# EAGLE design ads_pcb_v2 (EAGLE 7.7.0)
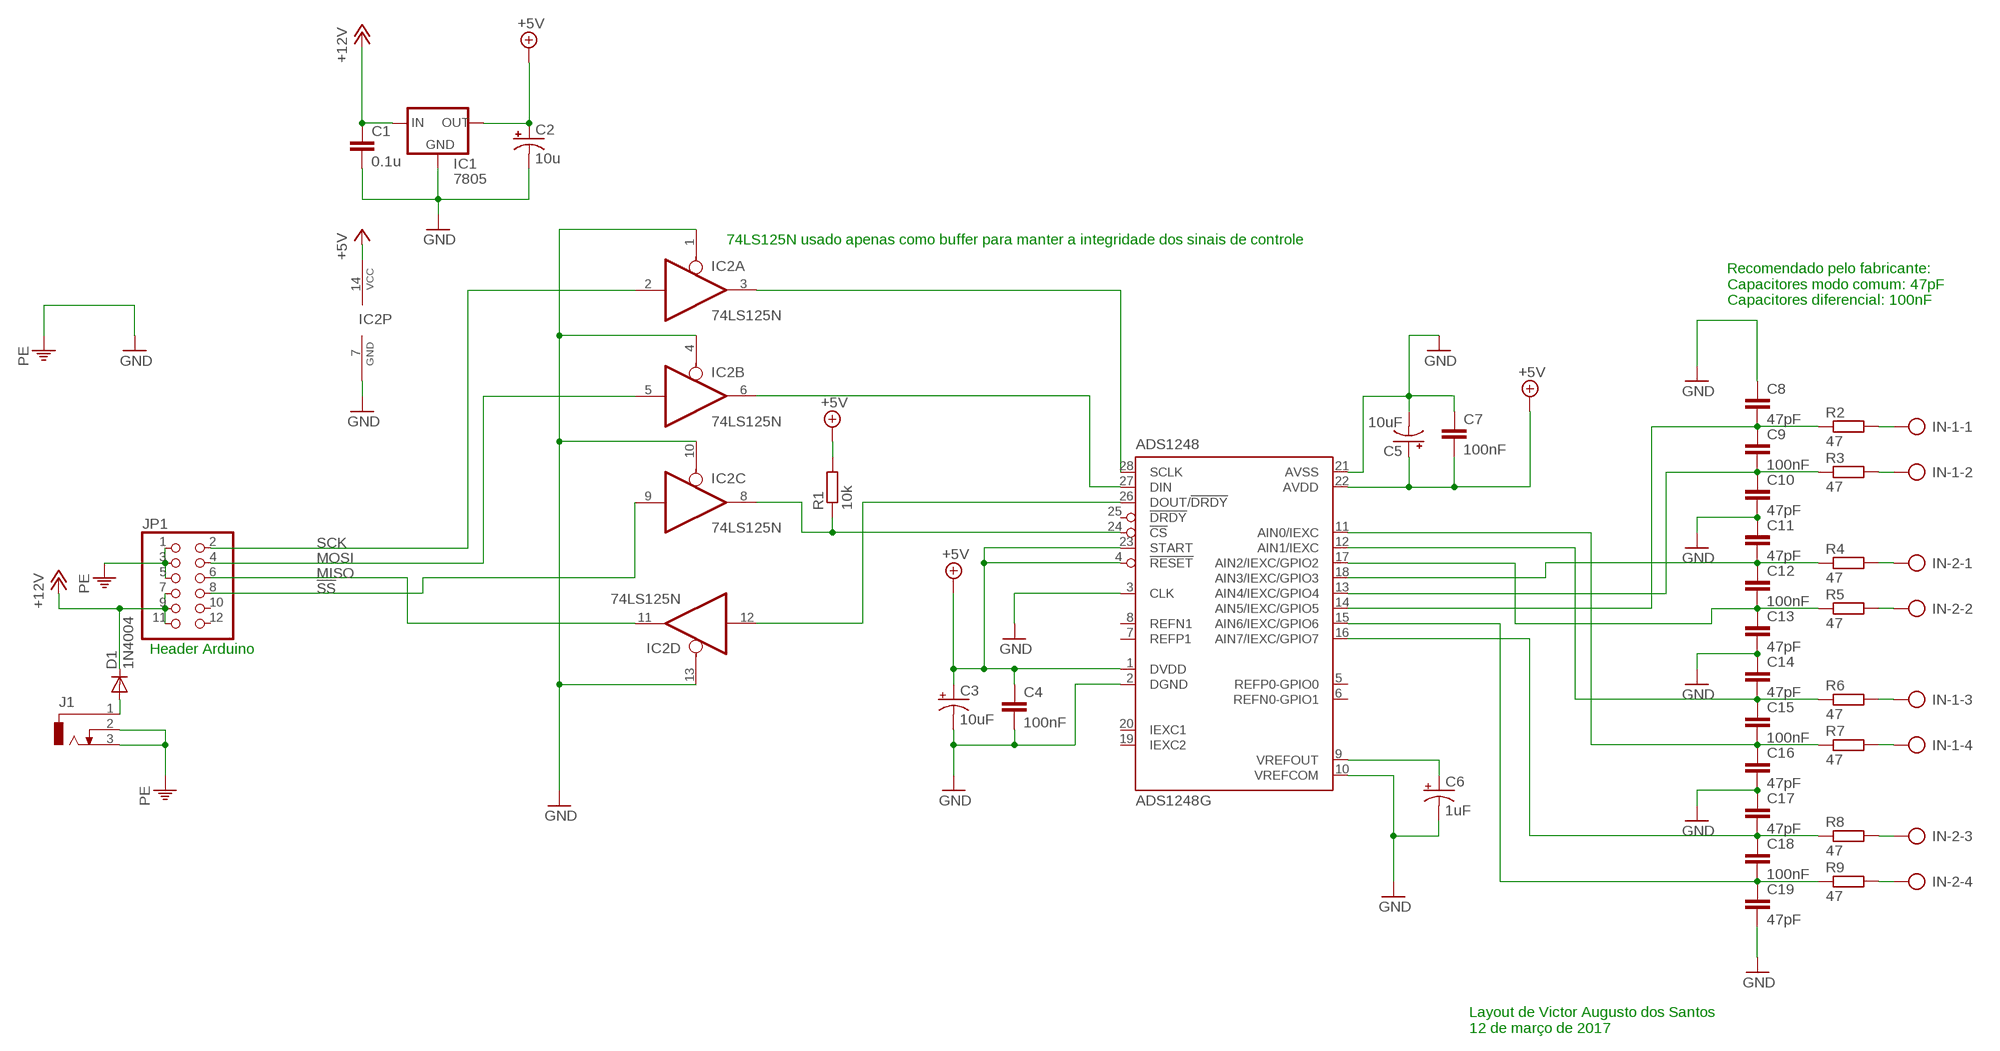
[diagram p0: schematic, sheet 1]

## Parts
C1  0.1u  C5/3  [C5B3]
C2  10u  CPOL-USE2-5  [E2-5]
C3  10uF  CPOL-USE2-5  [E2-5]
C4  100nF  C5/3  [C5B3]
C5  10uF  CPOL-USE2-5  [E2-5]
C6  1uF  CPOL-USE2-5  [E2-5]
C7  100nF  C5/3  [C5B3]
C8  47pF  C5/2.5  [C5B2.5]
C9  100nF  C5/2.5  [C5B2.5]
C10  47pF  C5/2.5  [C5B2.5]
C11  47pF  C5/2.5  [C5B2.5]
C12  100nF  C5/2.5  [C5B2.5]
C13  47pF  C5/2.5  [C5B2.5]
C14  47pF  C5/2.5  [C5B2.5]
C15  100nF  C5/2.5  [C5B2.5]
C16  47pF  C5/3  [C5B3]
C17  47pF  C5/2.5  [C5B2.5]
C18  100nF  C5/2.5  [C5B2.5]
C19  47pF  C5/2.5  [C5B2.5]
D1  1N4004  [DO41-10]
IC1  7805  78XXL  [78XXL]
IC2  74LS125N  [DIL14]
IC3  ADS1248G  [P-TSSOP28-1]
IN-1  AK500/4-H  [AK500/4-H]
IN-2  AK500/4-H  [AK500/4-H]
J1  DCJ0303  [DCJ0303]
JP1  PINHD-2X6  [2X06]
R1  10k  R-EU_0204/7  [0204/7]
R2  47  R-EU_0204/7  [0204/7]
R3  47  R-EU_0204/7  [0204/7]
R4  47  R-EU_0204/7  [0204/7]
R5  47  R-EU_0204/7  [0204/7]
R6  47  R-EU_0204/7  [0204/7]
R7  47  R-EU_0204/7  [0204/7]
R8  47  R-EU_0204/7  [0204/7]
R9  47  R-EU_0204/7  [0204/7]

## Nets
!SS: IC2.9(C:I) JP1.8
+5V: C2.+ C3.+ C4.1 C5.+ C7.2 IC1.OUT IC2.14(P:VCC) IC3.1(DVDD) IC3.4(!RESET) IC3.22(AVDD) IC3.23(START) R1.2
+12V: C1.1 D1.C IC1.IN JP1.7 JP1.9 JP1.11
GND: C1.2 C2.- C3.- C4.2 C5.- C6.- C7.1 C8.1 C10.2 C11.1 C13.2 C14.1 C16.2 C17.1 C19.2 IC1.GND IC2.1(A:OE) IC2.4(B:OE) IC2.7(P:GND) IC2.10(C:OE) IC2.13(D:OE) IC3.2(DGND) IC3.3(CLK) IC3.10(VREFCOM) IC3.21(AVSS) ; supply symbol labelled PE
MISO: IC2.11(D:O) JP1.6
MOSI: IC2.5(B:I) JP1.4
N$1: C6.+ IC3.9(VREFOUT)
N$2: C8.2 C9.1 IC3.14(AIN5/IEXC/GPIO5) R2.1
N$3: C9.2 C10.1 IC3.13(AIN4/IEXC/GPIO4) R3.1
N$4: IN-2.1 R4.2
N$5: IC2.3(A:O) IC3.28(SCLK)
N$6: IN-2.2 R5.2
N$7: C11.2 C12.1 IC3.18(AIN3/IEXC/GPIO3) R4.1
N$8: IN-1.3 R6.2
N$9: IN-1.4 R7.2
N$10: IN-2.3 R8.2
N$11: IC2.6(B:O) IC3.27(DIN)
N$12: IC2.12(D:I) IC3.26(DOUT/!DRDY)
N$13: IC2.8(C:O) IC3.24(!CS) R1.1
N$14: D1.A J1.1
N$15: IN-2.4 R9.2
N$16: IN-1.1 R2.2
N$18: IN-1.2 R3.2
N$21: C12.2 C13.1 IC3.17(AIN2/IEXC/GPIO2) R5.1
N$22: C17.2 C18.1 IC3.16(AIN7/IEXC/GPIO7) R8.1
N$23: C18.2 C19.1 IC3.15(AIN6/IEXC/GPIO6) R9.1
N$25: C15.2 C16.1 IC3.11(AIN0/IEXC) R7.1
N$26: C14.2 C15.1 IC3.12(AIN1/IEXC) R6.1
PE: J1.2 J1.3 JP1.1 JP1.3 JP1.5
SCK: IC2.2(A:I) JP1.2
Unconnected: IC3.5(REFP0-GPIO0) IC3.6(REFN0-GPIO1) IC3.7(REFP1) IC3.8(REFN1) IC3.19(IEXC2) IC3.20(IEXC1) IC3.25(!DRDY) JP1.10 JP1.12

## Notes on the sheet
- 74LS125N usado apenas como buffer para manter a integridade dos sinais de controle
- Recomendado pelo fabricante:
  Capacitores modo comum: 47pF
  Capacitores diferencial: 100nF
- Header Arduino
- Layout de Victor Augusto dos Santos
  12 de março de 2017

## Library data of the parts
C1 C4 C7-C19 = capacitor-wima:C: CAPACITOR naming: grid - package width
C2 C3 C5 C6 = resistor:CPOL-US: POLARIZED CAPACITOR, American symbol
D1 = adafruit:1N4004: DIODE General purpose 1N400x type rectifier (With bigger pads) http://www.ladyada.net/library/pcb/eaglelibrary.html
IC1 = v-reg:78XXL: VOLTAGE REGULATOR
IC2 = 74xx-us:74*125: Quad bus BUFFER, 3-state
IC3 = mylib:ADS1248: Phase locked loop (PLL), with a multistandard video modulator and a programmable sound FM and AM modulator
IN-1 IN-2 = con-ptr500:AK500/4-H: CONNECTOR Aug. 2004 / PTR Meßtechnik: Die Bezeichnung der Serie AK505 wurde geändert. Es handelt sich hierbei um AK500 in horizontaler Ausführung.
J1 = con-jack:DCJ0303: DC POWER JACK Source: DCJ0303.pdf; OC_FARNELL: unknown; OC_NEWARK: unknown
JP1 = pinhead:PINHD-2X6: PIN HEADER
R1-R9 = resistor:R-EU_: RESISTOR, European symbol

## Board
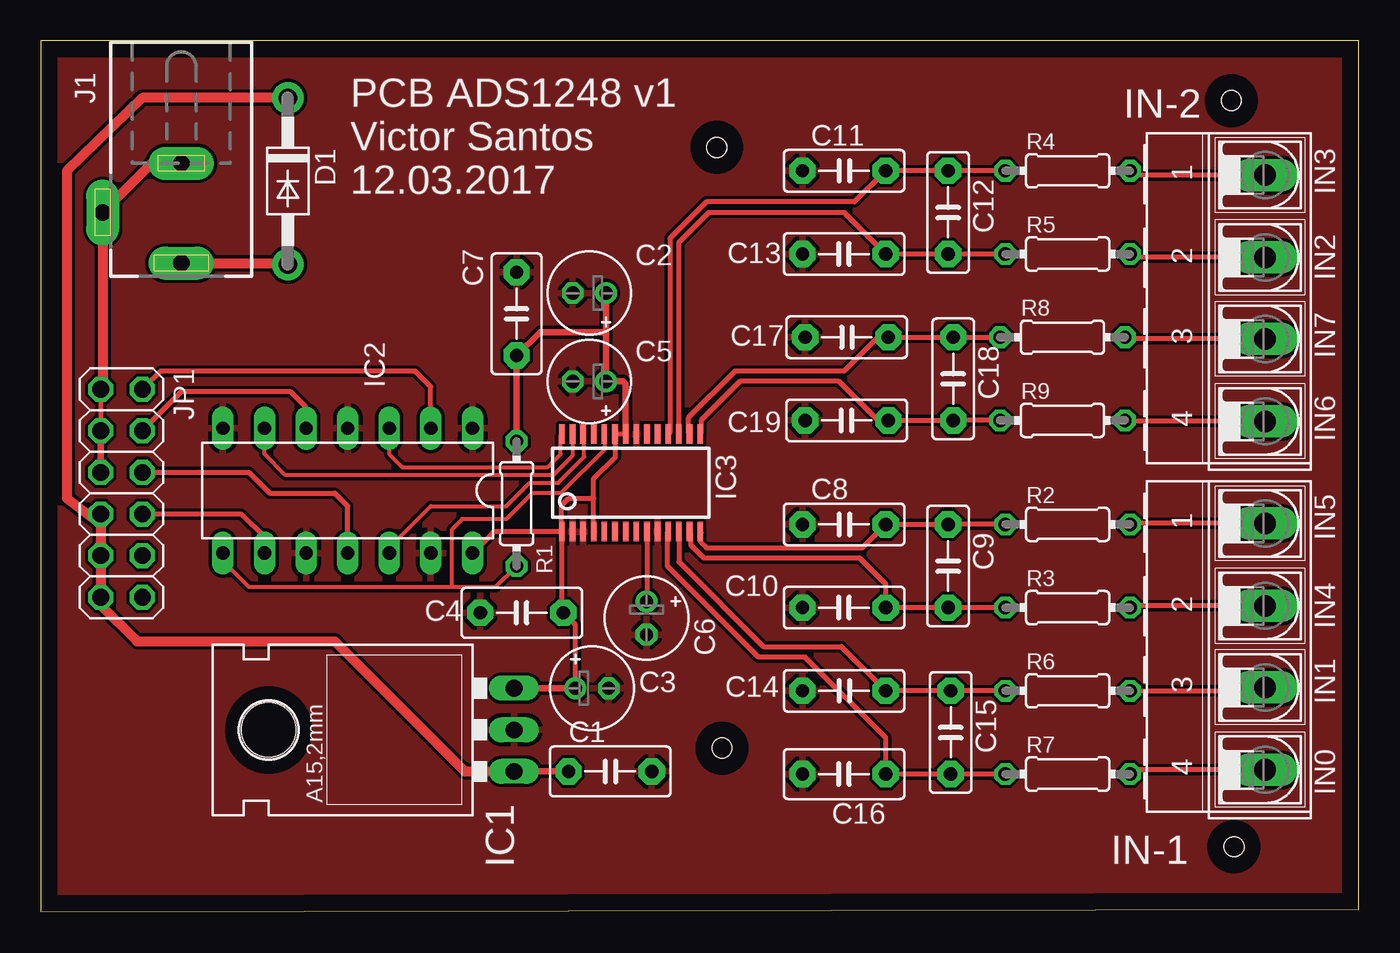
[diagram p1: board, top side]
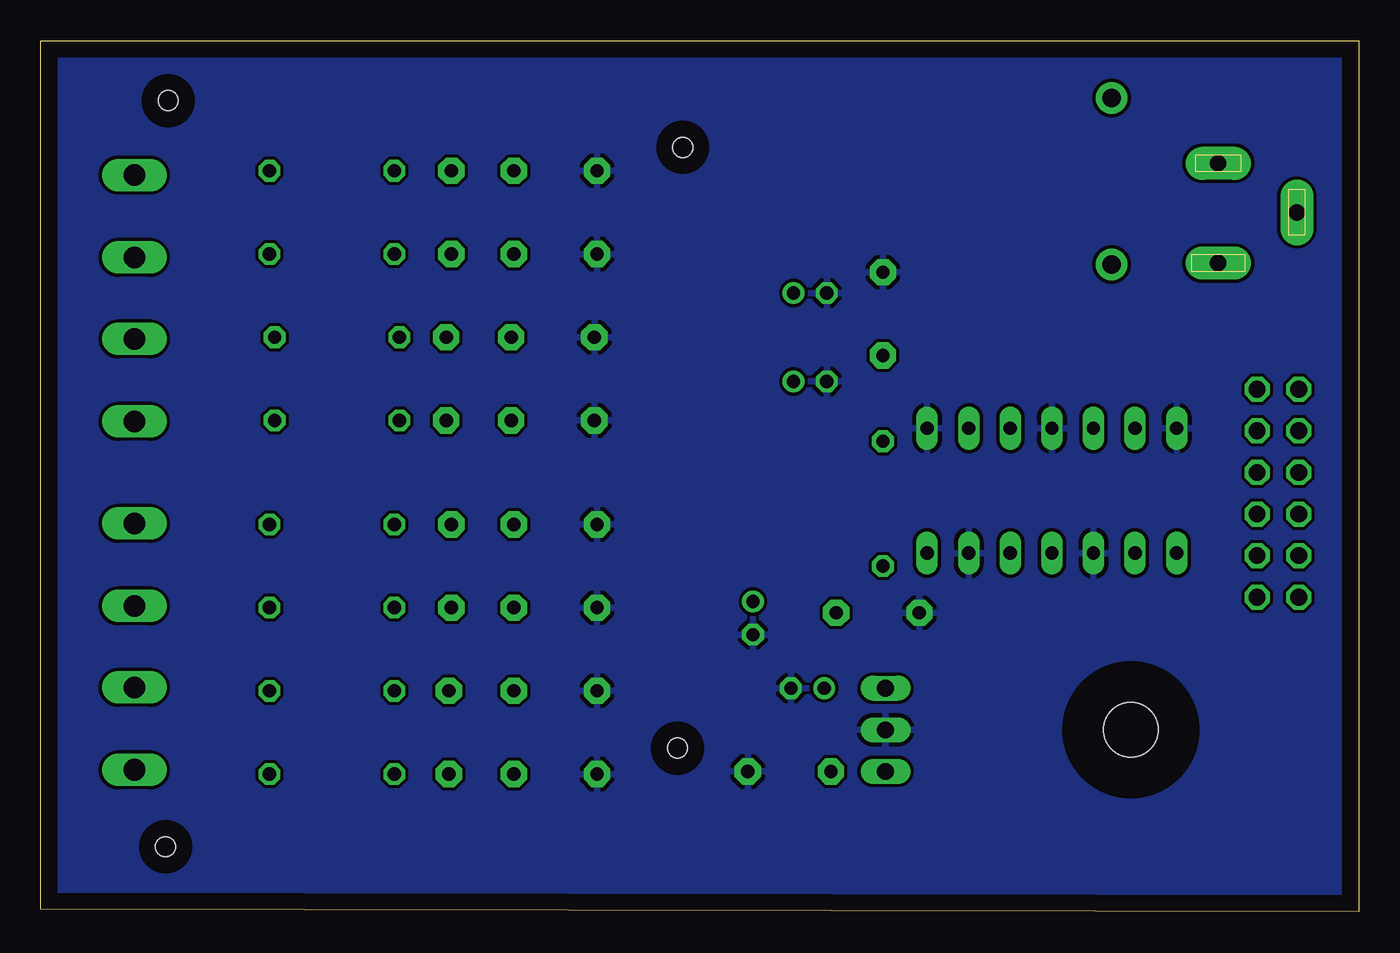
[diagram p2: board, bottom side, seen from below]

Size 80.47 x 53.17 mm. Coordinates in mm from the lower left corner, seen from the top.
Outline: 0,0 80.47,0.16 80.47,53.17 0,53.17 0,0
Copper layers (1*16): Top 0.035mm / dielectric 1.5mm / Bottom 0.035mm
Design rules "default": minimum track width 10mil, minimum drill 24mil, track to track 8mil, track to pad 8mil, pad to pad 8mil, via to via 8mil, smd to smd 8mil, copper to edge 40mil, drill to drill 8mil, minimum pad ring 10mil, minimum via ring 8mil, stop-mask expansion 4mil, vias tented up to drill 0mil, thermal gap 10mil
Holes 1.2 mm at 72.71,49.53 72.87,3.97 41.27,46.67 41.59,10

### Footprints (pad centres in the part's own frame; a part is rotated, then mirrored left to right if it is on the bottom)
C5B3 = drill 0.813 pad 1.6 octagon: 1 -2.54,0; 2 2.54,0
E2-5 = drill 0.813 pad 1.27: + -1.016,0 | drill 0.813 pad 1.27 octagon: - 1.016,0
C5B2.5 = drill 0.813 pad 1.6 octagon: 1 -2.54,0; 2 2.54,0
DO41-10 = drill 1.118 pad 1.93: A 5.08,0; C -5.08,0
78XXL = drill 1.016 long: GND 0,-3.81; IN -2.54,-3.81; OUT 2.54,-3.81 | hole 3.302: 0,11.176
DIL14 = drill 0.813 long: 1 -7.62,-3.81; 2 -5.08,-3.81; 3 -2.54,-3.81; 4 0,-3.81; 5 2.54,-3.81; 6 5.08,-3.81; 7 7.62,-3.81; 8 7.62,3.81; 9 5.08,3.81; 10 2.54,3.81; 11 0,3.81; 12 -2.54,3.81; 13 -5.08,3.81; 14 -7.62,3.81
P-TSSOP28-1 = smd 0.35 x 1.2: 1 -4.225,-2.975; 2 -3.575,-2.975; 3 -2.925,-2.975; 4 -2.275,-2.975; 5 -1.625,-2.975; 6 -0.975,-2.975; 7 -0.325,-2.975; 8 0.325,-2.975; 9 0.975,-2.975; 10 1.625,-2.975; 11 2.275,-2.975; 12 2.925,-2.975; 13 3.575,-2.975; 14 4.225,-2.975; 15 4.225,2.975; 16 3.575,2.975; 17 2.925,2.975; 18 2.275,2.975; 19 1.625,2.975; 20 0.975,2.975; 21 0.325,2.975; 22 -0.325,2.975; 23 -0.975,2.975; 24 -1.625,2.975; 25 -2.275,2.975; 26 -2.925,2.975; 27 -3.575,2.975; 28 -4.225,2.975
AK500/4-H = drill 1.321 long: 1 -7.518,0; 2 -2.489,0; 3 2.489,0; 4 7.518,0
DCJ0303 = drill 1 pad 2 long: 1 0,3.1; 2 4.8,0; 3 0,-3
2X06 = drill 1.016 octagon: 1 -6.35,-1.27; 2 -6.35,1.27; 3 -3.81,-1.27; 4 -3.81,1.27; 5 -1.27,-1.27; 6 -1.27,1.27; 7 1.27,-1.27; 8 1.27,1.27; 9 3.81,-1.27; 10 3.81,1.27; 11 6.35,-1.27; 12 6.35,1.27
0204/7 = drill 0.813 octagon: 1 -3.81,0; 2 3.81,0

### Placement (x,y rotation side)
C1  34.77,8.57 0 top
C2  33.5,37.78 180 top
C3  33.66,13.65 0 top
C4  29.37,18.26 180 top
C5  33.5,32.38 180 top
C6  36.99,17.94 270 top
C7  29.05,36.51 270 top
C8  49.05,23.65 0 top
C9  55.4,21.11 270 top
C10  49.05,18.57 180 top
C11  49.05,45.24 0 top
C12  55.4,42.7 270 top
C13  49.05,40.16 180 top
C14  49.05,13.49 0 top
C15  55.56,10.95 270 top
C16  49.05,8.41 180 top
C17  49.21,35.08 0 top
C18  55.72,32.54 270 top
C19  49.21,30 180 top
D1  15.08,44.61 270 top
IC1  25.08,11.11 90 top
IC2  18.73,25.72 180 top
IC3  36.04,26.19 0 top
IN-1  74.77,16.19 270 top
IN-2  74.77,37.47 270 top
J1  8.57,42.7 180 top
JP1  4.92,25.56 270 top
R1  29.05,24.92 90 top
R2  62.71,23.65 0 top
R3  62.71,18.57 0 top
R4  62.71,45.24 0 top
R5  62.71,40.16 0 top
R6  62.71,13.49 0 top
R7  62.71,8.41 0 top
R8  62.39,35.08 0 top
R9  62.39,30 0 top

### Tracks (layer width: path | path; a pad name or v marks a point on that pad's centre or on a via)
!SS
  Top 0.305: IC2.9 13.65,22.86 12.22,24.29 JP1.8
+5V
  Top 0.305: 33.81,23.22 IC3.4 33.76,25.24 | IC3.22 IC3.23 35.08,29.15 35.08,27.78 33.76,26.46 33.76,25.24 | IC3.1 27.66,23.22 IC2.14 | IC3.1 31.81,18.35 C4.1 32.64,17.53 C3.+ | IC3.1 31.81,24.83 32.23,25.24 33.76,25.24
  Top 0.406: IC3.22 35.71,32.23 35.56,32.38 C5.+ 34.51,35.4 | IC1.OUT C3.+ | C2.+ 34.51,35.4 | R1.2 C7.2 30.48,35.4 34.51,35.4
+12V
  Top 0.406: IC1.IN C1.1 | JP1.11 3.65,19.05
  Top 0.61: JP1.7 3.65,23.65 | 3.65,23.65 JP1.9 JP1.11 | 3.65,19.05 3.65,18.73 5.87,16.51 17.94,16.51 25.88,8.57 IC1.IN | D1.C 6.19,49.69 1.59,45.24 1.59,25.24 3.65,23.65
GND
  pour Top: -0.16,53.34 0,-0.16 80.96,-0.16 80.8,2.38 80.8,53.34
  pour Bottom: -0.16,53.18 -0.16,0 80.49,0 80.49,0.64 80.33,0.64 80.33,53.34 0.95,53.34
MISO
  Top 0.305: IC2.11 18.73,24.76 17.94,25.56 13.97,25.56 12.7,26.83 JP1.6
MOSI
  Top 0.305: IC2.5 16.19,30.8 15.24,31.75 8.57,31.75 JP1.4
N$1
  Top 0.305: IC3.9 37.01,18.98
  Top 0.61: C6.+ 37.01,18.98
N$2
  Top 0.305: R2.1 C9.1 C8.2 50.16,22.22 40.64,22.22 40.32,22.54 40.32,23.16 IC3.14
N$3
  Top 0.305: R3.1 C9.2 C10.1 51.59,20 50.01,21.59 40.48,21.59 39.69,22.38 39.69,23.14 IC3.13
N$4
  Top 0.305: IN-2.1 66.78,44.98 R4.2
N$5
  Top 0.254: IC2.3 21.27,27.94 22.07,27.15 30.96,27.15 31.75,27.94 31.75,29.11 IC3.28
N$6
  Top 0.305: IN-2.2 66.73,39.95 R5.2
N$7
  Top 0.305: R4.1 C12.1 C11.2 49.69,43.34 40.64,43.34 38.42,41.12 38.42,29.27 IC3.18
N$8
  Top 0.305: R6.2 74.56,13.49 IN-1.3
N$9
  Top 0.305: IN-1.4 66.78,8.67 R7.2
N$10
  Top 0.305: IN-2.3 66.31,34.98 R8.2
N$11
  Top 0.254: IC3.27 32.46,27.86 31.27,26.67 14.92,26.67 13.65,27.94 IC2.6
N$12
  Top 0.254: IC2.12 21.27,22.22 23.81,24.76 28.42,24.76 29.84,26.19 31.59,26.19 33.18,27.78 33.18,29.1 IC3.26
N$13
  Top 0.254: IC3.24 34.41,28.22 31.75,25.56 30,25.56 28.42,23.97 25.72,23.97 25.08,23.34 25.08,19.84 | IC2.8 11.11,21.43 12.7,19.84 25.08,19.84 | 25.08,19.84 27.78,19.84 R1.1
  Top 0.305: 34.45,29.21 IC3.24
N$14
  Top 0.61: J1.1 15.01,39.6 D1.A
N$15
  Top 0.305: IN-2.4 66.26,29.95 R9.2
N$16
  Top 0.305: IN-1.1 66.57,23.71 R2.2
N$18
  Top 0.305: IN-1.2 66.62,18.68 R3.2
N$21
  Top 0.305: R5.1 C12.2 C13.1 49.05,42.7 40.8,42.7 38.96,40.87 IC3.17
N$22
  Top 0.305: R8.1 C18.1 C17.2 51.12,35.08 49.05,33.02 42.39,33.02 39.53,30.16 39.53,29.25 IC3.16
N$23
  Top 0.305: R9.1 C18.2 C19.1 51.12,30 48.74,32.38 42.7,32.38 40.32,30 40.32,29.23 IC3.15
N$25
  Top 0.305: R7.1 C15.2 C16.1 51.59,10.64 46.67,15.56 43.81,15.56 38.26,21.11 38.26,23.17 IC3.11
N$26
  Top 0.305: R6.1 C15.1 C14.2 48.89,16.19 44.13,16.19 38.96,21.36 IC3.12
PE
  Top 0.305: JP1.1 JP1.3
  Top 0.406: JP1.3 JP1.5
  Top 0.61: J1.3 6.77,45.7 J1.2 3.77,32.03 JP1.1
SCK
  Top 0.305: IC2.2 23.81,32.07 22.86,33.02 7.3,33.02 JP1.2

### Text on the board
tNames: PCB ADS1248 v1 / Victor Santos / 12.03.2017 | IN3 | IN2 | IN7 | IN6 | IN5 | IN4 | IN1 | IN0